# EAGLE design 4093_quad_lfo (EAGLE 8.0.0)

## Sheet 1 of 2
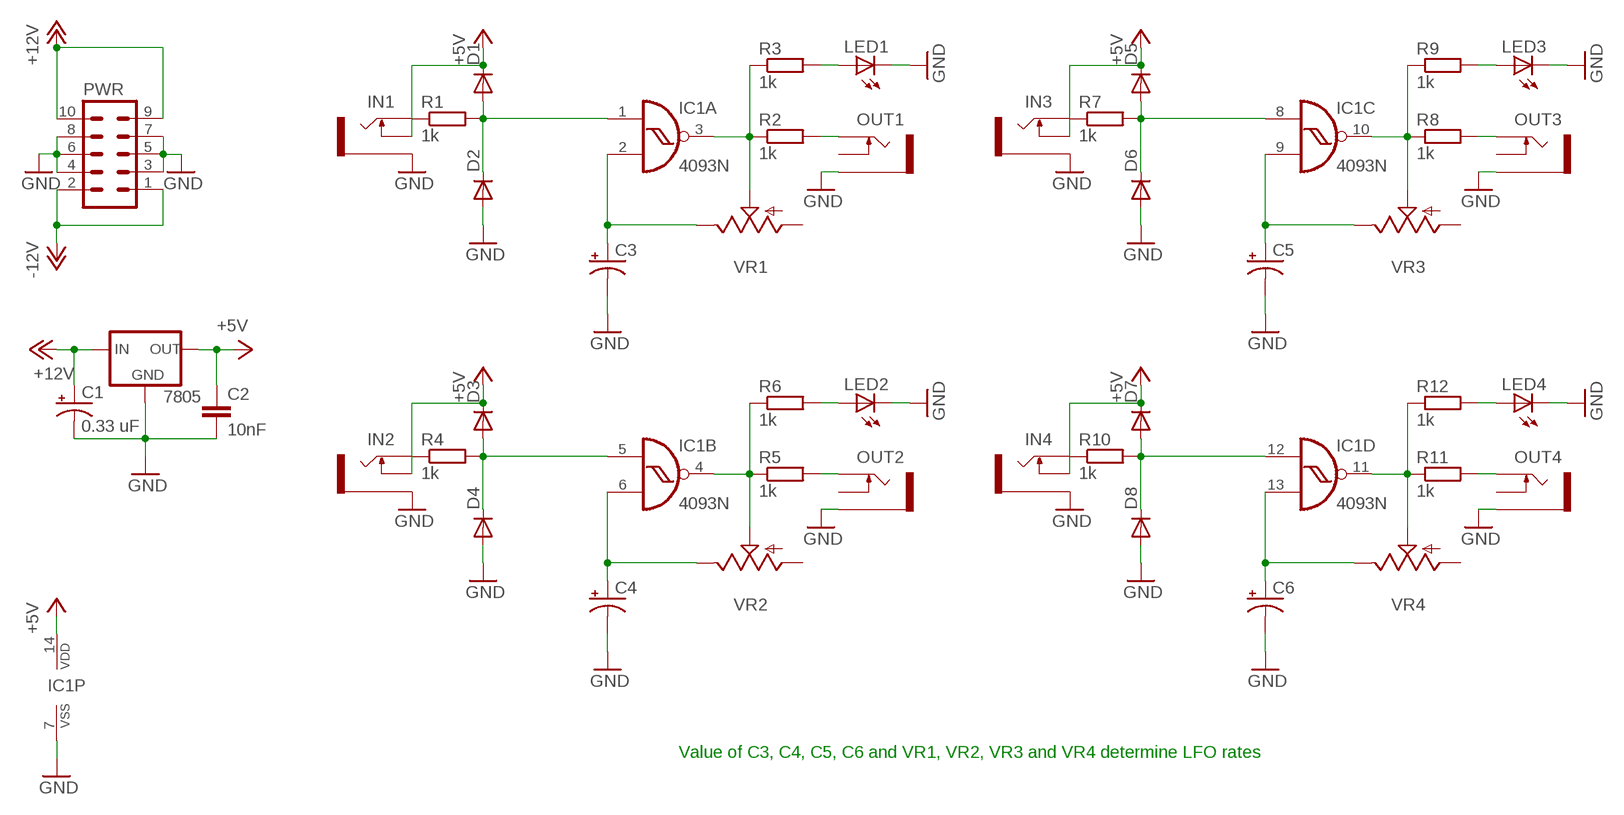
[diagram p0: schematic, sheet 1]

### Parts
7805  78XXS  [78XXS]
C1  0.33 uF  CPOL-USE2.5-7  [E2,5-7]
C2  10nF  10NF-PTH-10MM-10000V-1-%  [CAP-PTH-10MM]
C3  CPOL-USE2.5-7  [E2,5-7]
C4  CPOL-USE2.5-7  [E2,5-7]
C5  CPOL-USE2.5-7  [E2,5-7]
C6  CPOL-USE2.5-7  [E2,5-7]
D1  SMALL_DIODEDO35-7  [DO35-7]
D2  SMALL_DIODEDO35-7  [DO35-7]
D3  SMALL_DIODEDO35-7  [DO35-7]
D4  SMALL_DIODEDO35-7  [DO35-7]
D5  SMALL_DIODEDO35-7  [DO35-7]
D6  SMALL_DIODEDO35-7  [DO35-7]
D7  SMALL_DIODEDO35-7  [DO35-7]
D8  SMALL_DIODEDO35-7  [DO35-7]
IC1  4093N  [DIL14]
IN1  THONKICONNNEW  [WQP-PJ301M-12_JACK]
IN2  THONKICONNNEW  [WQP-PJ301M-12_JACK]
IN3  THONKICONNNEW  [WQP-PJ301M-12_JACK]
IN4  THONKICONNNEW  [WQP-PJ301M-12_JACK]
LED1  LED3MM  [LED3MM]
LED2  LED3MM  [LED3MM]
LED3  LED3MM  [LED3MM]
LED4  LED3MM  [LED3MM]
OUT1  THONKICONNNEW  [WQP-PJ301M-12_JACK]
OUT2  THONKICONNNEW  [WQP-PJ301M-12_JACK]
OUT3  THONKICONNNEW  [WQP-PJ301M-12_JACK]
OUT4  THONKICONNNEW  [WQP-PJ301M-12_JACK]
PWR  EURO_POWER_HEADERFAT_PADS  [EURO_PWR_HEADER_FAT]
R1  1k  RESISTOR7MM  [7MM_RESISTOR]
R2  1k  RESISTOR7MM  [7MM_RESISTOR]
R3  1k  RESISTOR7MM  [7MM_RESISTOR]
R4  1k  RESISTOR7MM  [7MM_RESISTOR]
R5  1k  RESISTOR7MM  [7MM_RESISTOR]
R6  1k  RESISTOR7MM  [7MM_RESISTOR]
R7  1k  RESISTOR7MM  [7MM_RESISTOR]
R8  1k  RESISTOR7MM  [7MM_RESISTOR]
R9  1k  RESISTOR7MM  [7MM_RESISTOR]
R10  1k  RESISTOR7MM  [7MM_RESISTOR]
R11  1k  RESISTOR7MM  [7MM_RESISTOR]
R12  1k  RESISTOR7MM  [7MM_RESISTOR]
VR1  9MM_SNAP-IN_POT_  [9MM_SNAP-IN_POT]
VR2  9MM_SNAP-IN_POT_  [9MM_SNAP-IN_POT]
VR3  9MM_SNAP-IN_POT_  [9MM_SNAP-IN_POT]
VR4  9MM_SNAP-IN_POT_  [9MM_SNAP-IN_POT]

### Nets
+5V: 7805.OUT C2.1 D1.C D3.C D5.C D7.C IC1.14(P:VDD) IN1.P$2_SWITCH(SWITCH) IN2.P$2_SWITCH(SWITCH) IN3.P$2_SWITCH(SWITCH) IN4.P$2_SWITCH(SWITCH)
+12V: 7805.IN C1.+ PWR.9 PWR.10
-12V: PWR.1 PWR.2
GND: 7805.GND C1.- C2.2 C3.- C4.- C5.- C6.- D2.A D4.A D6.A D8.A IC1.7(P:VSS) IN1.P$3_SLEEVE(SLEEVE) IN2.P$3_SLEEVE(SLEEVE) IN3.P$3_SLEEVE(SLEEVE) IN4.P$3_SLEEVE(SLEEVE) LED1.K(C) LED2.K(C) LED3.K(C) LED4.K(C) OUT1.P$3_SLEEVE(SLEEVE) OUT2.P$3_SLEEVE(SLEEVE) OUT3.P$3_SLEEVE(SLEEVE) OUT4.P$3_SLEEVE(SLEEVE) PWR.3 PWR.4 PWR.5 PWR.6 PWR.7 PWR.8
N$1: IN1.P$1_TIP(TIP) R1.1
N$2: D3.A D4.C IC1.5(B:I0) R4.2
N$3: LED1.A R3.2
N$4: C3.+ IC1.2(A:I1) VR1.3(E)
N$5: IC1.3(A:O) R2.1 R3.1 VR1.2(S)
N$6: OUT1.P$1_TIP(TIP) R2.2
N$7: IN2.P$1_TIP(TIP) R4.1
N$8: C4.+ IC1.6(B:I1) VR2.3(E)
N$9: IC1.4(B:O) R5.1 R6.1 VR2.2(S)
N$10: OUT2.P$1_TIP(TIP) R5.2
N$11: LED2.A R6.2
N$12: D5.A D6.C IC1.8(C:I0) R7.2
N$13: IN3.P$1_TIP(TIP) R7.1
N$14: C5.+ IC1.9(C:I1) VR3.3(E)
N$15: IC1.10(C:O) R8.1 R9.1 VR3.2(S)
N$16: OUT3.P$1_TIP(TIP) R8.2
N$17: LED3.A R9.2
N$19: D1.A D2.C IC1.1(A:I0) R1.2
N$20: D7.A D8.C IC1.12(D:I0) R10.2
N$21: IN4.P$1_TIP(TIP) R10.1
N$22: C6.+ IC1.13(D:I1) VR4.3(E)
N$23: IC1.11(D:O) R11.1 R12.1 VR4.2(S)
N$24: OUT4.P$1_TIP(TIP) R11.2
N$25: LED4.A R12.2
Unconnected: OUT1.P$2_SWITCH(SWITCH) OUT2.P$2_SWITCH(SWITCH) OUT3.P$2_SWITCH(SWITCH) OUT4.P$2_SWITCH(SWITCH) VR1.1(A) VR2.1(A) VR3.1(A) VR4.1(A)

### Notes on the sheet
- Value of C3, C4, C5, C6 and VR1, VR2, VR3 and VR4 determine LFO rates

## Sheet 2 of 2

## Library data of the parts
7805 = v-reg:78XXS: VOLTAGE REGULATOR
C1 C3-C6 = rcl:CPOL-US: POLARIZED CAPACITOR, American symbol
C2 = SparkFun-Capacitors:10NF: 0.01uF/10nF/10,000pF ceramic capacitors A capacitor is a passive two-terminal electrical component used to store electrical energy temporarily in an electric field. CAP-09321; PROD_ID: CAP-09321
D1-D8 = MusicThingModular:SMALL_DIODE: Small Signal Diode
IC1 = 40xx:4093: Quad 2-input NAND schmitt trigger
IN1-IN4 OUT1-OUT4 = MusicThingModular:THONKICONN: 3.5mm socket for Eurorack modular synths
LED1-LED4 = led:LED: LED OSRAM: - CHIPLED LG R971, LG N971, LY N971, LG Q971, LY Q971, LO R971, LY R971 LH N974, LH R974 LS Q976, LO Q976, LY Q976 LO Q996 - Hyper CHIPLED LW Q18S LB Q993, LB Q99A, LB R99A - SideLED LS A670, LO A670, LY A670, LG A670, LP A670 LB A673, LV A673, LT A673, LW A673 LH A674 LY A675 LS A676, LA A676, LO A676, LY A676, LW A676 LS A679, LY A679, LG A679 - Hyper Micro SIDELED® LS Y876, LA Y876, LO Y876, LY Y876 LT Y87S - SmartLED LW L88C, LW L88S LB L89C, LB L89S, LG L890 LS L89K, LO L89K, LY L89K LS L896, LA L896, LO L896, LY L896 - TOPLED LS T670, LO T670, LY T670, LG T670, LP T670 LSG T670, LSP T670, LSY T670, LOP T670, LYG T670 LG T671, LOG T671, LSG T671 LB T673, LV T673, LT T673, LW T673 LH T674 LS T676, LA T676, LO T676, LY T676, LB T676, LH T676, LSB T676, LW T676 LB T67C, LV T67C, LT T67C, LS T67K, LO T67K, LY T67K, LW E67C LS E67B, LA E67B, LO E67B, LY E67B, LB E67C, LV E67C, LT E67C LW T67C LS T679, LY T679, LG T679 LS T770, LO T770, LY T770, LG T770, LP T770 LB T773, LV T773, LT T773, LW T773 LH T774 LS E675, LA E675, LY E675, LS T675 LS T776, LA T776, LO T776, LY T776, LB T776 LHGB T686 LT T68C, LB T68C - Hyper Mini TOPLED® LB M676 - Mini TOPLED Santana® LG M470 LS M47K, LO M47K, LY M47K Source: http://www.osram.convergy.de LUXEON: - LUMILED® LXK2-PW12-R00, LXK2-PW12-S00, LXK2-PW14-U00, LXK2-PW14-V00 LXK2-PM12-R00, LXK2-PM12-S00, LXK2-PM14-U00 LXK2-PE12-Q00, LXK2-PE12-R00, LXK2-PE12-S00, LXK2-PE14-T00, LXK2-PE14-U00 LXK2-PB12-K00, LXK2-PB12-L00, LXK2-PB12-M00, LXK2-PB14-N00, LXK2-PB14-P00, LXK2-PB14-Q00 LXK2-PR12-L00, LXK2-PR12-M00, LXK2-PR14-Q00, LXK2-PR14-R00 LXK2-PD12-Q00, LXK2-PD12-R00, LXK2-PD12-S00 LXK2-PH12-R00, LXK2-PH12-S00 LXK2-PL12-P00, LXK2-PL12-Q00, LXK2-PL12-R00 Source: www.luxeon.com KINGBRIGHT: KA-3528ASYC Source: www.kingbright.com
PWR = MusicThingModular:EURO_POWER_HEADER: Power Header 10 pin power header for Eurorack Power Supplies Variants with fatter pads for easier soldering, and the LOCK variant which has 5mil offset pins to hold the component in place before soldering
R1-R12 = MusicThingModular:RESISTOR: Standard resistor, various versions
VR1-VR4 = MusicThingModular:9MM_SNAP-IN_POT: 9mm vertical snap-in pot, Alpha / Panasonic style

## Board
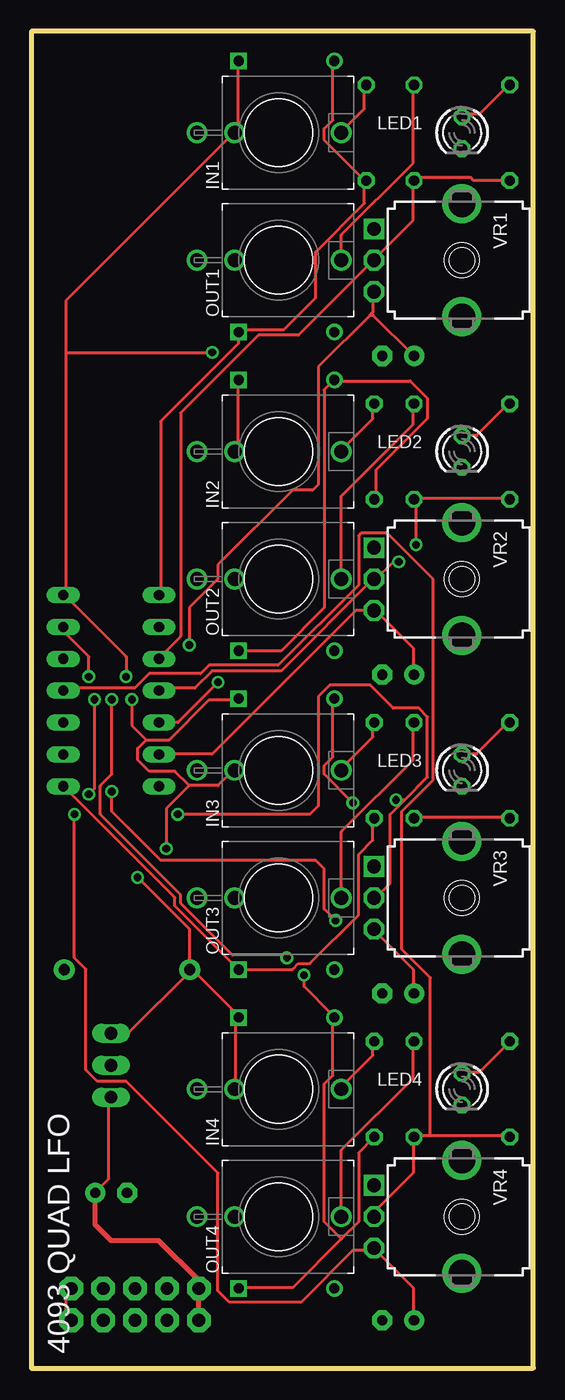
[diagram p1: board, top side]
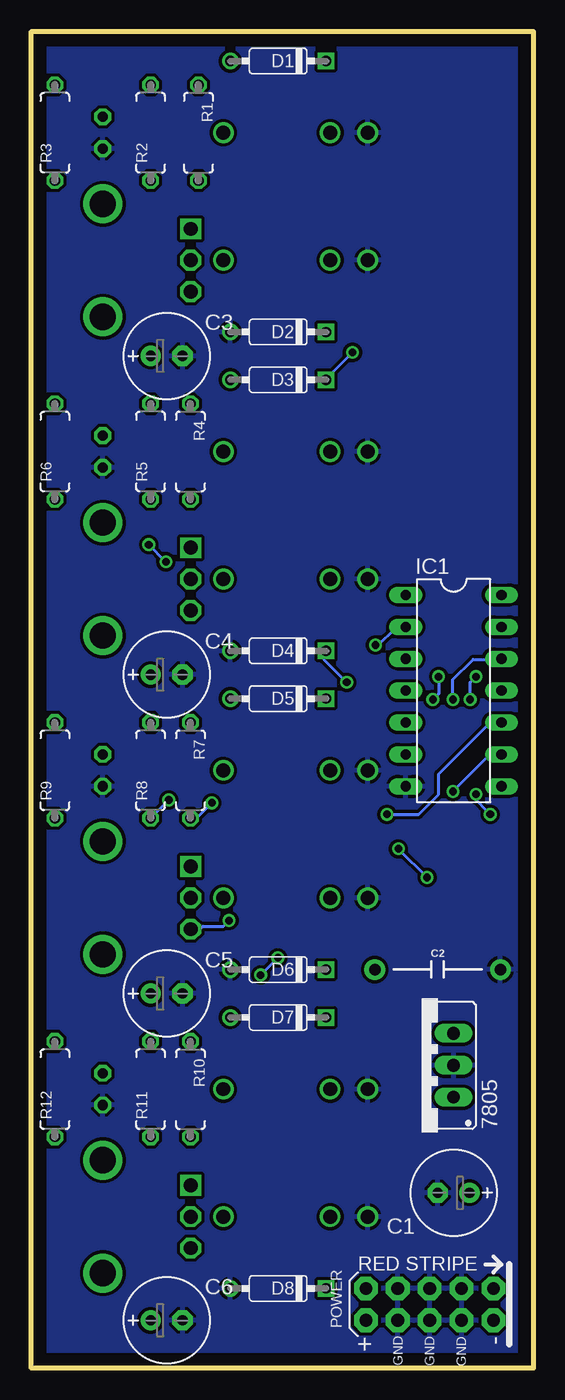
[diagram p2: board, bottom side, seen from below]

Size 39.98 x 106.5 mm. Coordinates in mm from the lower left corner, seen from the top.
Outline: 0,0 39.98,0 39.98,106.5 0,106.5 0,0
Copper layers (1*16): Top 0.035mm / dielectric 1.5mm / Bottom 0.035mm
Design rules "default": minimum track width 10mil, minimum drill 24mil, track to track 8mil, track to pad 8mil, pad to pad 8mil, via to via 8mil, smd to smd 8mil, copper to edge 40mil, drill to drill 8mil, minimum pad ring 10mil, minimum via ring 8mil, stop-mask expansion 4mil, vias tented up to drill 0mil, thermal gap 10mil

### Footprints (pad centres in the part's own frame; a part is rotated, then mirrored left to right if it is on the bottom)
78XXS = drill 1.016 long: GND 0,-2.54; IN -2.54,-2.54; OUT 2.54,-2.54
E2,5-7 = drill 0.813 pad 1.6: + -1.27,0 | drill 0.813 pad 1.6 octagon: - 1.27,0
CAP-PTH-10MM = drill 0.9 pad 1.651: 1 -5,0; 2 5,0
DO35-7 = drill 0.813: A 3.81,0 | drill 0.813 square: C -3.81,0
DIL14 = drill 0.813 long: 1 -7.62,-3.81; 2 -5.08,-3.81; 3 -2.54,-3.81; 4 0,-3.81; 5 2.54,-3.81; 6 5.08,-3.81; 7 7.62,-3.81; 8 7.62,3.81; 9 5.08,3.81; 10 2.54,3.81; 11 0,3.81; 12 -2.54,3.81; 13 -5.08,3.81; 14 -7.62,3.81
WQP-PJ301M-12_JACK = drill 1.1: P$1_TIP 0,5; P$2_SWITCH 0,-3.5; P$3_SLEEVE 0,-6.5
LED3MM = drill 0.813 octagon: A -1.27,0; K 1.27,0
EURO_PWR_HEADER_FAT = drill 1.016 pad 1.88 octagon: 1 -5.08,-1.27; 2 -5.08,1.27; 3 -2.54,-1.27; 4 -2.54,1.27; 5 0,-1.27; 6 0,1.27; 7 2.54,-1.27; 8 2.54,1.27; 9 5.08,-1.27; 10 5.08,1.27
7MM_RESISTOR = drill 0.813 octagon: 1 -3.81,0; 2 3.81,0
9MM_SNAP-IN_POT = drill 1.1 square: 1 -2.5,-7 | drill 1.1 octagon: 2 0,-7; 3 2.5,-7 | drill 2.1 pad 2.794: CHASSIS1 -4.5,0; CHASSIS2 4.5,0

### Placement (x,y rotation side)
7805  8.89,24.13 90 bottom
C1  6.35,13.97 180 bottom
C2  7.62,31.75 0 bottom
C3  29.21,80.64 0 bottom
C4  29.21,55.24 0 bottom
C5  29.21,29.84 0 bottom
C6  29.21,3.81 0 bottom
D1  20.32,104.14 180 bottom
D2  20.32,82.55 180 bottom
D3  20.32,78.74 180 bottom
D4  20.32,57.15 180 bottom
D5  20.32,53.34 180 bottom
D6  20.32,31.75 180 bottom
D7  20.32,27.94 180 bottom
D8  20.32,6.35 180 bottom
IC1  6.35,53.98 270 bottom
IN1  19.68,98.42 270 top
IN2  19.68,73.03 270 top
IN3  19.68,47.62 270 top
IN4  19.68,22.23 270 top
LED1  34.29,98.42 270 top
LED2  34.29,73.03 270 top
LED3  34.29,47.62 270 top
LED4  34.29,22.23 270 top
OUT1  19.68,88.27 270 top
OUT2  19.68,62.87 270 top
OUT3  19.68,37.47 270 top
OUT4  19.68,12.06 270 top
PWR  8.26,5.08 180 bottom
R1  26.67,98.42 270 bottom
R2  30.48,98.42 90 bottom
R3  38.1,98.42 90 bottom
R4  27.3,73.03 270 bottom
R5  30.48,73.03 90 bottom
R6  38.1,73.03 90 bottom
R7  27.3,47.62 270 bottom
R8  30.48,47.62 90 bottom
R9  38.1,47.62 90 bottom
R10  27.3,22.23 270 bottom
R11  30.48,22.23 90 bottom
R12  38.1,22.23 90 bottom
VR1  34.29,88.27 270 top
VR2  34.29,62.87 270 top
VR3  34.29,37.47 270 top
VR4  34.29,12.06 270 top

### Tracks (layer width: path | path; a pad name or v marks a point on that pad's centre or on a via)
+5V  (via drill 0.61)
  Top 0.254: C2.1 12.8,31.77 16.46,28.12 D7.C 16.23,27.66 16.23,22.4 IN4.P$2_SWITCH | 7805.OUT 6.4,26.75 7.77,26.75 12.57,31.55 C2.1 | 9.14,50.06 10.97,50.06 14.17,53.26 16.46,53.26 D5.C | 9.14,50.06 8.46,49.38 8.46,48.46 9.37,47.55 11.43,47.55 12.57,46.41 | 12.57,46.41 14.86,46.41 16,47.55 IN3.P$2_SWITCH | D3.C 16.46,78.64 16.46,73.38 16.23,73.15 IN2.P$2_SWITCH | 2.74,80.92 2.74,85.04 16,98.3 IN1.P$2_SWITCH 16.23,98.53 16.46,98.75 16.46,104.01 D1.C | 2.74,80.92 2.74,61.72 IC1.14 2.74,61.49 7.54,56.69 v7.54,55.09 | 2.74,80.92 v14.4,80.92 | 9.14,50.06 8,51.21 v8,53.26 | v8.46,39.09 12.57,34.98 12.57,31.77 C2.1 | v10.74,41.38 10.74,44.58 12.57,46.41
  Bottom 0.254: v14.4,80.92 16.46,78.87 D3.C | v8,53.26 7.54,53.72 v7.54,55.09 | v10.74,41.38 v8.46,39.09
+12V
  Top 0.254: 7805.IN 6.17,21.49 6.17,15.09 5.26,14.17 C1.+
  Top 0.406: PWR.10 PWR.9 13.34,6.99 10.16,10.16 6.35,10.16 5.08,11.43 C1.+
-12V
  Top 0.254: PWR.2 2.74,3.89 2.74,6.17 PWR.1
GND
  pour Bottom (isolate 0.254): -1.27,107.95 41.91,107.95 41.91,-1.27 -1.27,-1.27
N$1
  Top 0.254: R1.1 26.52,102.18 26.52,100.36 24.69,98.53 IN1.P$1_TIP
N$2  (via drill 0.61)
  Top 0.254: IC1.5 11.66,51.44 v14.86,54.63 | R4.2 27.43,69.27 27.43,71.55 31.55,75.67 31.55,77.27 30.18,78.64 24.23,78.64 D3.A 24,78.64 23.32,77.95 23.32,60.58 19.89,57.15 D4.C
  Bottom 0.254: v14.86,54.63 16.69,56.46 16.69,57.15 D4.C
N$3
  Top 0.254: LED1.A 34.29,99.9 35.66,99.9 37.95,102.18 R3.2
N$4  (via drill 0.61)
  Top 0.254: v12.57,57.61 12.57,60.58 14.86,62.87 14.86,64.01 20.8,69.95 22.4,69.95 22.86,70.41 22.86,79.78 26.98,83.9 | 26.98,83.9 27.2,84.12 27.2,85.72 VR1.3 | 26.98,83.9 27.2,83.9 30.4,80.7 C3.+
  Bottom 0.254: v12.57,57.61 12.34,57.61 10.97,58.98 10.29,58.98 IC1.2
N$5
  Top 0.254: IC1.3 10.29,56.69 11.89,58.29 11.89,76.12 18.06,82.3 21.26,82.3 27.2,88.24 VR1.2 27.43,88.47 30.4,91.44 30.4,94.41 R2.1 30.63,94.64 30.86,94.87 34.98,94.87 35.2,94.64 37.95,94.64 R3.1
N$6
  Top 0.254: R2.2 30.4,102.18 30.4,96.01 24.69,90.3 24.69,88.47 OUT1.P$1_TIP
N$7
  Top 0.254: R4.1 27.2,76.81 27.2,75.67 24.69,73.15 IN2.P$1_TIP
N$8
  Top 0.254: IC1.6 10.29,48.92 14.4,48.92 25.83,60.35 27.2,60.35 VR2.3 27.43,60.35 30.4,57.38 30.4,55.32 C4.+
N$9  (via drill 0.61)
  Top 0.254: R6.1 37.95,69.27 30.63,69.27 R5.1 30.63,69.04 v30.63,65.61 | IC1.4 10.29,54.18 13.03,54.18 14.4,55.55 19.89,55.55 27.2,62.87 VR2.2 27.43,62.87 28.8,64.24 v29.26,64.24
  Bottom 0.254: v29.26,64.24 v30.63,65.61
N$10
  Top 0.254: R5.2 30.4,76.81 30.4,75.21 24.69,69.49 OUT2.P$1_TIP
N$11
  Top 0.254: LED2.A 35.43,74.3 37.95,76.81 R6.2
N$12  (via drill 0.61)
  Top 0.254: IC1.8 2.74,46.18 11.43,37.49 11.43,36.8 16.46,31.77 D6.C 16.69,31.77 20.8,31.77 21.26,32.23 22.17,32.23 26.06,36.12 26.06,40.92 27.2,42.06 27.2,43.66 R7.2 | v25.6,45.03 23.32,47.32 23.32,48.01 24,48.69 24,53.26 D5.A
  Bottom 0.254: v25.6,45.03 26.75,43.89 27.2,43.89 R7.2
N$13
  Top 0.254: R7.1 27.2,51.44 27.2,50.29 24.69,47.78 IN3.P$1_TIP
N$14  (via drill 0.61)
  Top 0.254: v6.4,45.95 6.4,44.35 10.29,40.46 22.63,40.46 23.32,39.78 23.32,36.58 v24.23,35.66 | C5.+ 30.4,29.95 30.4,31.77 27.43,34.75 VR3.3
  Bottom 0.254: v6.4,45.95 3.66,48.69 2.74,48.69 IC1.9 | v24.23,35.66 24.69,35.2 26.29,35.2 26.52,34.98 27.2,34.98 VR3.3
N$15  (via drill 0.61)
  Top 0.254: R8.1 30.63,43.89 37.95,43.89 R9.1 | v11.66,44.12 22.17,44.12 22.86,44.81 22.86,53.49 23.77,54.41 26.98,54.41 28.8,52.58 30.86,52.58 31.55,51.89 31.55,47.09 29.72,45.26 | 29.72,45.26 28.57,44.12 28.57,38.63 27.43,37.49 VR3.2 | 29.72,45.26 v29.03,45.26
  Bottom 0.254: IC1.10 3.43,51.44 7.54,47.32 7.54,45.72 9.14,44.12 v11.66,44.12 | v29.03,45.26 R8.1
N$16
  Top 0.254: R8.2 30.4,51.44 30.4,48.46 24.69,42.75 24.69,37.49 OUT3.P$1_TIP
N$17
  Top 0.254: LED3.A 34.29,48.92 35.43,48.92 37.95,51.44 R9.2
N$19
  Top 0.254: D1.A 24,104.01 24,99.44 23.32,98.75 23.32,97.84 26.52,94.64 R1.2 26.52,94.41 26.52,92.81 22.63,88.92 22.63,85.27 20.12,82.75 16.69,82.75 D2.C 16.46,82.53 16.46,81.61 10.29,75.44 10.29,61.72 IC1.1
N$20  (via drill 0.61)
  Top 0.254: 24.69,10.29 26.06,11.66 26.06,17.14 27.2,18.29 R10.2 | 24.69,10.29 20.8,6.4 16.69,6.4 D8.C | 24.69,10.29 23.32,11.66 23.32,22.63 24,23.32 24,27.89 D7.A 24,28.12 21.72,30.4 v21.72,31.32 | v6.4,53.26 6.4,47.32 5.49,46.41 5.49,44.12 11.89,37.72 11.89,37.03 16,32.92 20.12,32.92 v20.34,32.69
  Bottom 0.254: v6.4,53.26 6.4,54.86 4.8,56.46 2.74,56.46 IC1.12 | v21.72,31.32 v20.34,32.69
N$21
  Top 0.254: R10.1 27.2,25.83 27.2,24.92 24.69,22.4 IN4.P$1_TIP
N$22  (via drill 0.61)
  Top 0.254: v4.57,55.09 4.57,56.69 2.74,58.52 2.74,58.98 IC1.13 | v5.03,53.26 5.03,46.18 v4.57,45.72 | v3.43,44.12 3.43,32.69 4.34,31.77 4.34,23.77 5.26,22.86 7.54,22.86 14.86,15.54 14.86,6.17 15.77,5.26 21.49,5.26 25.6,9.37 27.2,9.37 VR4.3 27.43,9.37 30.4,6.4 30.4,3.89 C6.+
  Bottom 0.254: v4.57,55.09 5.03,54.63 v5.03,53.26 | v4.57,45.72 4.8,45.49 v3.43,44.12
N$23
  Top 0.254: 31.77,18.52 37.95,18.52 R12.1 | 31.77,18.52 30.63,18.52 R11.1 30.4,18.29 30.4,15.54 27.43,12.57 27.43,12.12 VR4.2 | 31.77,18.52 31.77,31.09 29.49,33.38 29.49,44.35 32,46.86 32,62.87 28.35,66.52 26.29,66.52 26.06,66.29 26.06,62.41 19.66,56.01 14.17,56.01 13.49,55.32 9.37,55.32 8.23,54.18 2.74,54.18 IC1.11
N$24
  Top 0.254: R11.2 30.4,25.83 30.4,23.09 24.69,17.37 24.69,12.12 OUT4.P$1_TIP
N$25
  Top 0.254: LED4.A 34.29,23.55 35.66,23.55 37.95,25.83 R12.2

### Text on the board
tNames: 4093 QUAD LFO